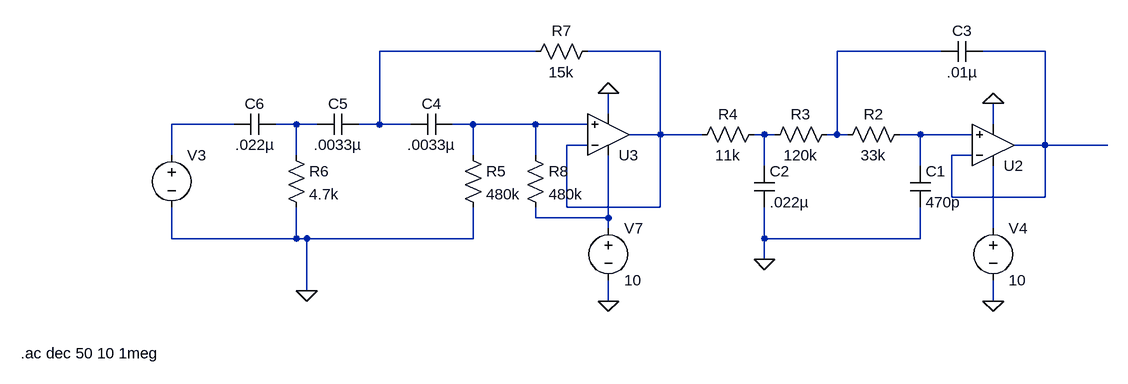
[diagram p0: schematic SixthBP.asc]
SixthBP.asc, the LTspice schematic file:
Version 4
SHEET 1 2228 724
WIRE 1344 240 1104 240
WIRE 1536 240 1424 240
WIRE 1968 240 1808 240
WIRE 2128 240 2032 240
WIRE 1456 336 1456 304
WIRE 880 352 784 352
WIRE 976 352 944 352
WIRE 1008 352 976 352
WIRE 1104 352 1104 240
WIRE 1104 352 1072 352
WIRE 1152 352 1104 352
WIRE 1248 352 1216 352
WIRE 1344 352 1248 352
WIRE 1424 352 1344 352
WIRE 2048 352 2048 320
WIRE 1536 368 1536 240
WIRE 1536 368 1488 368
WIRE 1600 368 1536 368
WIRE 1696 368 1680 368
WIRE 1712 368 1696 368
WIRE 1808 368 1808 240
WIRE 1808 368 1792 368
WIRE 1824 368 1808 368
WIRE 1936 368 1904 368
WIRE 2016 368 1936 368
WIRE 1424 384 1392 384
WIRE 2128 384 2128 240
WIRE 2128 384 2080 384
WIRE 2224 384 2128 384
WIRE 784 400 784 352
WIRE 976 400 976 352
WIRE 1248 400 1248 352
WIRE 1344 400 1344 352
WIRE 2016 400 1984 400
WIRE 1696 416 1696 368
WIRE 1936 416 1936 368
WIRE 1984 464 1984 400
WIRE 2128 464 2128 384
WIRE 2128 464 1984 464
WIRE 1392 480 1392 384
WIRE 1536 480 1536 368
WIRE 1536 480 1392 480
WIRE 1344 496 1344 480
WIRE 1456 496 1456 400
WIRE 1456 496 1344 496
WIRE 1456 512 1456 496
WIRE 2048 512 2048 416
WIRE 784 528 784 480
WIRE 976 528 976 480
WIRE 976 528 784 528
WIRE 992 528 976 528
WIRE 1248 528 1248 480
WIRE 1248 528 992 528
WIRE 1696 528 1696 480
WIRE 1936 528 1936 480
WIRE 1936 528 1696 528
WIRE 1696 560 1696 528
WIRE 992 608 992 528
WIRE 1456 624 1456 592
WIRE 2048 624 2048 592
FLAG 1696 560 0
FLAG 2048 624 0
FLAG 992 608 0
FLAG 1456 624 0
FLAG 1456 304 0
FLAG 2048 320 0
SYMBOL res 1920 352 R90
WINDOW 0 0 56 VBottom 2
WINDOW 3 32 56 VTop 2
SYMATTR InstName R2
SYMATTR Value 33k
SYMBOL res 1808 352 R90
WINDOW 0 0 56 VBottom 2
WINDOW 3 32 56 VTop 2
SYMATTR InstName R3
SYMATTR Value 120k
SYMBOL res 1696 352 R90
WINDOW 0 0 56 VBottom 2
WINDOW 3 32 56 VTop 2
SYMATTR InstName R4
SYMATTR Value 11k
SYMBOL cap 1920 416 R0
SYMATTR InstName C1
SYMATTR Value 470p
SYMBOL cap 1680 416 R0
SYMATTR InstName C2
SYMATTR Value .022µ
SYMBOL cap 2032 224 R90
WINDOW 0 0 32 VBottom 2
WINDOW 3 32 32 VTop 2
SYMATTR InstName C3
SYMATTR Value .01µ
SYMBOL voltage 784 384 R0
SYMATTR InstName V3
SYMATTR Value ""
SYMATTR Value2 AC 1
SYMBOL Opamps/UniversalOpamp2 2048 384 M180
SYMATTR InstName U2
SYMBOL voltage 2048 496 R0
SYMATTR InstName V4
SYMATTR Value 10
SYMBOL Opamps/UniversalOpamp2 1456 368 M180
SYMATTR InstName U3
SYMBOL cap 1216 336 R90
WINDOW 0 0 32 VBottom 2
WINDOW 3 32 32 VTop 2
SYMATTR InstName C4
SYMATTR Value .0033µ
SYMBOL cap 1072 336 R90
WINDOW 0 0 32 VBottom 2
WINDOW 3 32 32 VTop 2
SYMATTR InstName C5
SYMATTR Value .0033µ
SYMBOL cap 944 336 R90
WINDOW 0 0 32 VBottom 2
WINDOW 3 32 32 VTop 2
SYMATTR InstName C6
SYMATTR Value .022µ
SYMBOL res 1232 384 R0
SYMATTR InstName R5
SYMATTR Value 480k
SYMBOL res 960 384 R0
SYMATTR InstName R6
SYMATTR Value 4.7k
SYMBOL res 1440 224 R90
WINDOW 0 0 56 VBottom 2
WINDOW 3 32 56 VTop 2
SYMATTR InstName R7
SYMATTR Value 15k
SYMBOL voltage 1456 496 R0
SYMATTR InstName V7
SYMATTR Value 10
SYMBOL res 1328 384 R0
SYMATTR InstName R8
SYMATTR Value 480k
TEXT 552 704 Left 2 !.ac dec 50 10 1meg

The netlist it stands for:
* SixthBP.asc
R2 N009 N003 33k
R3 N003 N008 120k
R4 N008 N002 11k
C1 N009 0 470p
C2 N008 0 .022µ
C3 N004 N003 .01µ
V3 N005 0 AC 1
XU2 N009 N004 N011 0 N004 level.2 Avol=1Meg GBW=10Meg Slew=10Meg ilimit=25m rail=0 Vos=0 phimargin=45 en=0 enk=0 in=0 ink=0 Rin=500Meg  ; pins IN+ IN- V+ V- OUT
V4 N011 0 10
XU3 N007 N002 N010 0 N002 level.2 Avol=1Meg GBW=10Meg Slew=10Meg ilimit=25m rail=0 Vos=0 phimargin=45 en=0 enk=0 in=0 ink=0 Rin=500Meg  ; pins IN+ IN- V+ V- OUT
C4 N007 N001 .0033µ
C5 N001 N006 .0033µ
C6 N006 N005 .022µ
R5 N007 0 480k
R6 N006 0 4.7k
R7 N002 N001 15k
V7 N010 0 10
R8 N007 N010 480k
.ac dec 50 10 1meg
.lib UniversalOpamps2.sub
.backanno
.end